# EAGLE schematic BLE -- HM-10 & ATtiny85 Combo -- v04 (EAGLE 6.4)
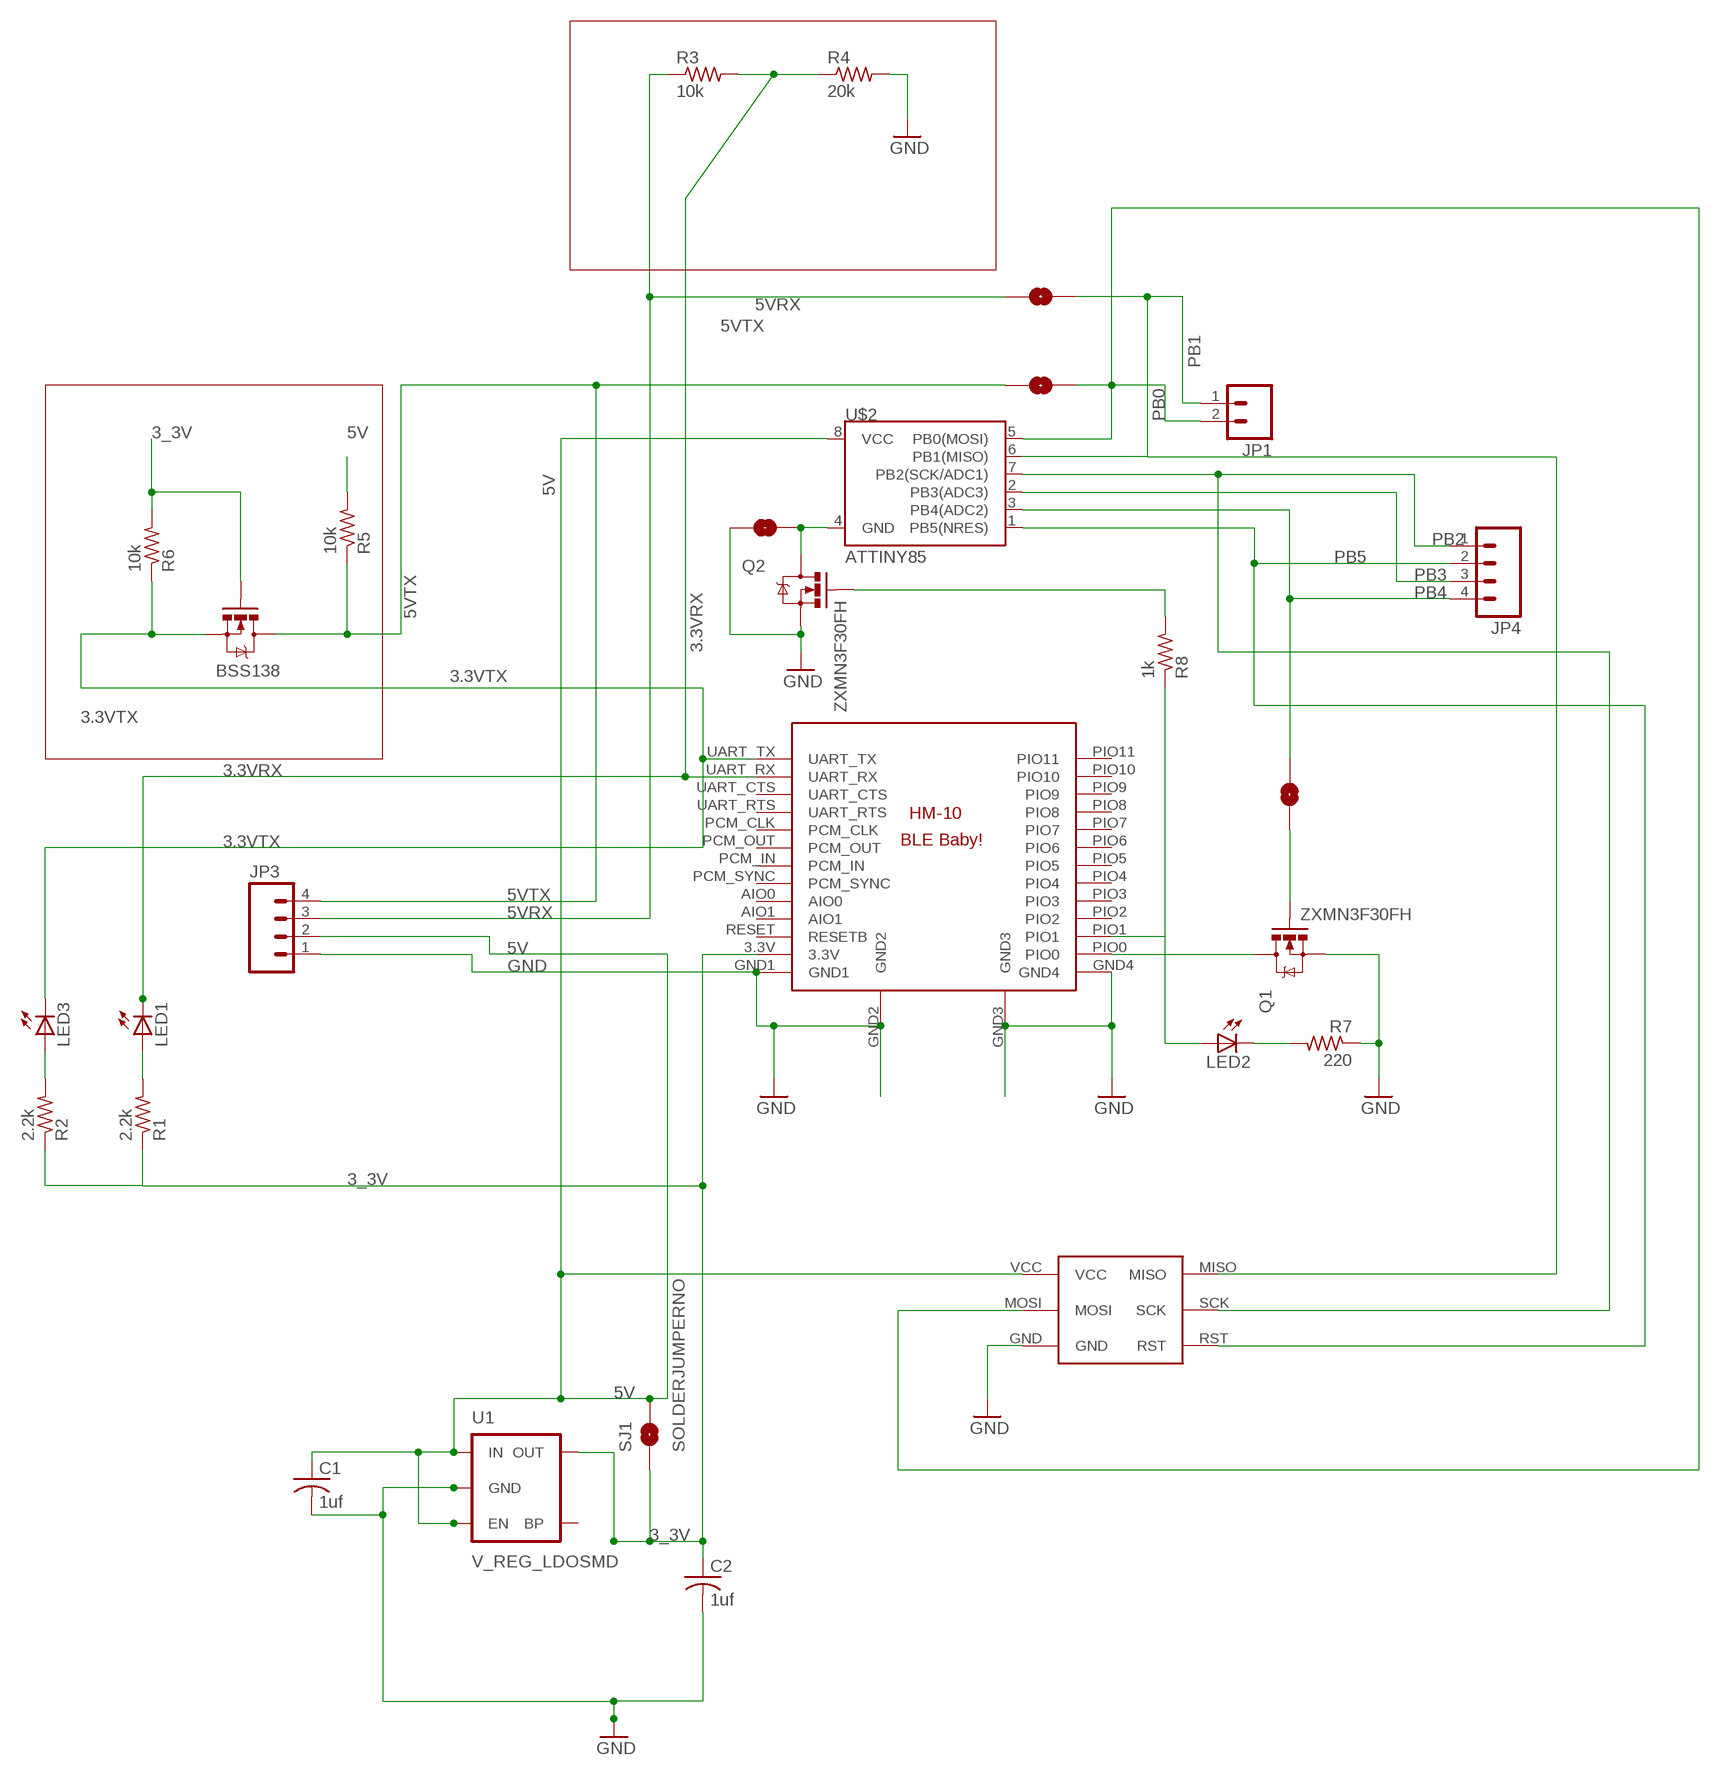
[diagram p0: schematic, sheet 1]

## Parts
BSS138  MOSFET-NCHANNELSMD  [SOT23-3]
C1  1uf  C-USC0402  [C0402]
C2  1uf  C-USC0402  [C0402]
JP1  M02PTH  [1X02]
JP3  M04PTH  [1X04]
JP4  M04PTH  [1X04]
LED1  LED0603  [LED-0603]
LED2  LED0603  [LED-0603]
LED3  LED0603  [LED-0603]
Q1  ZXMN3F30FH  MOSFET-NCHANNELSMD  [SOT23-3]
Q2  ZXMN3F30FH  MOSFET-NCHANNELSMD  [SOT23-3]
R1  2.2k  R-US_R0402  [R0402]
R2  2.2k  R-US_R0402  [R0402]
R3  10k  R-US_R0402  [R0402]
R4  20k  R-US_R0402  [R0402]
R5  10k  R-US_R0402  [R0402]
R6  10k  R-US_R0402  [R0402]
R7  220  R-US_R0402  [R0402]
R8  1k  R-US_R0402  [R0402]
SJ1  SOLDERJUMPERNO  [SJ_2S-NO]
SJ2  SOLDERJUMPERNO  [SJ_2S-NO]
SJ3  SOLDERJUMPERNO  [SJ_2S-NO]
SJ4  SOLDERJUMPERNO  [SJ_2S-NO]
SJ5  SOLDERJUMPERNO  [SJ_2S-NO]
U1  V_REG_LDOSMD  [SOT23-5]
U$1  BLE-HM10_NO_SPI  [BLE-HM10_NO_SPI]
U$2  ATTINY85  ATTINY45  [SO08-EIAJ]
U$4  POGO_PIN_SPI_PAD  [POGO_PIN_SPI_PAD]

## Nets
3.3VRX: LED1.C R3.2 R4.1 U$1.UART_RX
3.3VTX: BSS138.2(S) LED3.C R6.1 U$1.UART_TX
3_3V: BSS138.1(G) C2.1 R1.1 R2.1 R6.2 SJ1.1 U1.5(OUT) U$1.3.3V
5V: C1.1 JP3.2 R5.2 SJ1.2 U1.1(IN) U1.3(EN) U$2.8(VCC) U$4.VCC
5VRX: JP3.3 R3.1 SJ3.2
5VTX: BSS138.3(D) JP3.4 R5.1 SJ2.2
GND: C1.2 C2.2 JP3.1 Q1.2(S) Q2.2(S) R4.2 R7.1 SJ5.1 U1.2(GND) U$1.GND1 U$1.GND2 U$1.GND3 U$1.GND4 U$4.GND
N$1: Q1.1(G) SJ4.2
N$2: Q2.1(G) R8.2
N$3: LED1.A R1.2
N$4: LED2.A R8.1 U$1.PIO1
N$5: LED3.A R2.2
N$12: Q2.3(D) SJ5.2 U$2.4(GND)
N$13: Q1.3(D) U$1.PIO0
N$26: LED2.C R7.2
PB0: JP1.2 SJ2.1 U$2.5(PB0(MOSI)) U$4.MOSI
PB1: JP1.1 SJ3.1 U$2.6(PB1(MISO)) U$4.MISO
PB2: JP4.1 U$2.7(PB2(SCK/ADC1)) U$4.SCK
PB3: JP4.3 U$2.2(PB3(ADC3))
PB4: JP4.4 SJ4.1 U$2.3(PB4(ADC2))
PB5: JP4.2 U$2.1(PB5(NRES)) U$4.RST
Unconnected: U1.4(BP) U$1.AIO0 U$1.AIO1 U$1.PCM_CLK U$1.PCM_IN U$1.PCM_OUT U$1.PCM_SYNC U$1.PIO2 U$1.PIO3 U$1.PIO4 U$1.PIO5 U$1.PIO6 U$1.PIO7 U$1.PIO8 U$1.PIO9 U$1.PIO10 U$1.PIO11 U$1.RESET(RESETB) U$1.UART_CTS U$1.UART_RTS

## Library data of the parts
BSS138 Q1 Q2 = SparkFun:MOSFET-NCHANNEL
C1 C2 = resistor:C-US: CAPACITOR, American symbol
JP1 = SparkFun:M02: Header 2 Standard 2-pin 0.1" header. Use with straight break away headers (SKU : PRT-00116), right angle break away headers (PRT-00553), swiss pins (PRT-00743), machine pins (PRT-00117), and female headers (PRT-00115). Molex polarized connector foot print use with SKU : PRT-08233 with associated crimp pins and housings.
JP3 JP4 = SparkFun:M04: Header 4 Standard 4-pin 0.1" header. Use with straight break away headers (SKU : PRT-00116), right angle break away headers (PRT-00553), swiss pins (PRT-00743), machine pins (PRT-00117), and female headers (PRT-00115). Molex polarized connector foot print use with SKU : PRT-08231 with associated crimp pins and housings. 1MM SMD Version SKU: PRT-10208
LED1-LED3 = SparkFun:LED: LEDs Standard schematic elements and footprints for 5mm, 3mm, 1206, and 0603 sized LEDs. 5mm - Spark Fun Electronics SKU : COM-00529 (and others)
R1-R8 = resistor:R-US_: RESISTOR, American symbol
SJ1-SJ5 = SparkFun:SOLDERJUMPER: Solder Jumper Standard SMD solder jumper. Used to automate production. Two varients : Normally Open and Normally Closed are the same, but have different paste layers. NC will have a large amount of paste and should jumper during reflow.
U1 = SparkFun:V_REG_LDO: Voltage Regulator LDO Standard 150mA LDO voltage regulator in SOT-23 layout. Micrel part MIC5205. BP (by-pass) pin is used to lower output noise with 470pF cap.
U$1 = Random parts:BLE-HM10_NO_SPI
U$2 = SparkFun:ATTINY45: Atmel ATTiny45
U$4 = Random parts:POGO_PIN_SPI_PAD